# EAGLE design RaspberryShield (EAGLE 6.5.0)
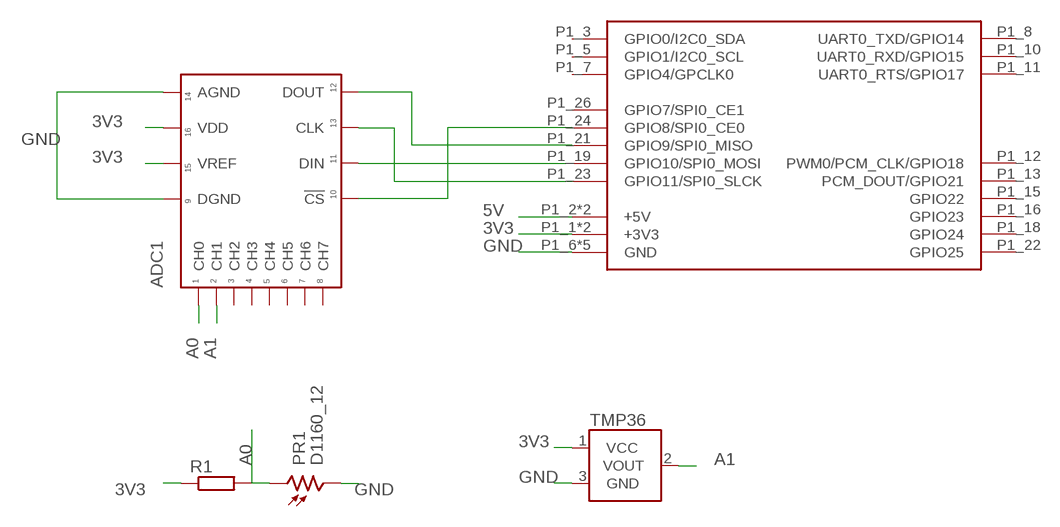
[diagram p0: schematic, sheet 1]

## Parts
ADC1  21298EDIP  [DIP16]
PR1  D1160_12  [D11XX]
R1  R-EU_0207/7  [0207/7]
TMP36  TMP36GT9  [TO-92]
U$1  RPI-B-V1SHIELD  [RPI-B-V1-SHIELD]

## Nets
3V3: ADC1.P$15(VREF) ADC1.P$16(VDD) R1.1 TMP36.1(VCC) U$1.P1_1(+3V3) U$1.P1_17(+3V3)
5V: U$1.P1_2(+5V) U$1.P1_4(+5V)
A0: ADC1.P$1(CH0) PR1.1 R1.2
A1: ADC1.P$2(CH1) TMP36.2(VOUT)
GND: ADC1.P$9(DGND) ADC1.P$14(AGND) PR1.2 TMP36.3(GND) U$1.P1_6(GND) U$1.P1_9(GND) U$1.P1_14(GND) U$1.P1_20(GND) U$1.P1_25(GND)
N$3: ADC1.P$12(DOUT) U$1.P1_21(GPIO9/SPI0_MISO)
N$4: ADC1.P$11(DIN) U$1.P1_19(GPIO10/SPI0_MOSI)
N$5: ADC1.P$13(CLK) U$1.P1_23(GPIO11/SPI0_SLCK)
N$6: ADC1.P$10(!CS) U$1.P1_24(GPIO8/SPI0_CE0)
Unconnected: ADC1.P$3(CH2) ADC1.P$4(CH3) ADC1.P$5(CH4) ADC1.P$6(CH5) ADC1.P$7(CH6) ADC1.P$8(CH7) U$1.P1_3(GPIO0/I2C0_SDA) U$1.P1_5(GPIO1/I2C0_SCL) U$1.P1_7(GPIO4/GPCLK0) U$1.P1_8(UART0_TXD/GPIO14) U$1.P1_10(UART0_RXD/GPIO15) U$1.P1_11(UART0_RTS/GPIO17) U$1.P1_12(PWM0/PCM_CLK/GPIO18) U$1.P1_13(PCM_DOUT/GPIO21) U$1.P1_15(GPIO22) U$1.P1_16(GPIO23) U$1.P1_18(GPIO24) U$1.P1_22(GPIO25) U$1.P1_26(GPIO7/SPI0_CE1)

## Library data of the parts
ADC1 = Microchip:21298E
PR1 = photo-elements:D11: Photo Sensor Oil Burner Control Applications Source: http://optoelectronics.perkinelmer.com/content/Datasheets/DTS_PhotocellsD1160.pdf
R1 = resistor:R-EU_: RESISTOR, European symbol
TMP36 = SparkFun-Sensors:TMP36: Precision degC temp sensor, analog out
U$1 = raspberry:RPI-B-V1: First revision of the Model B board without P5 and P6 headers and mounting holes. Choose the "SHIELD" variant for a predefined Dimension layer.

## Board
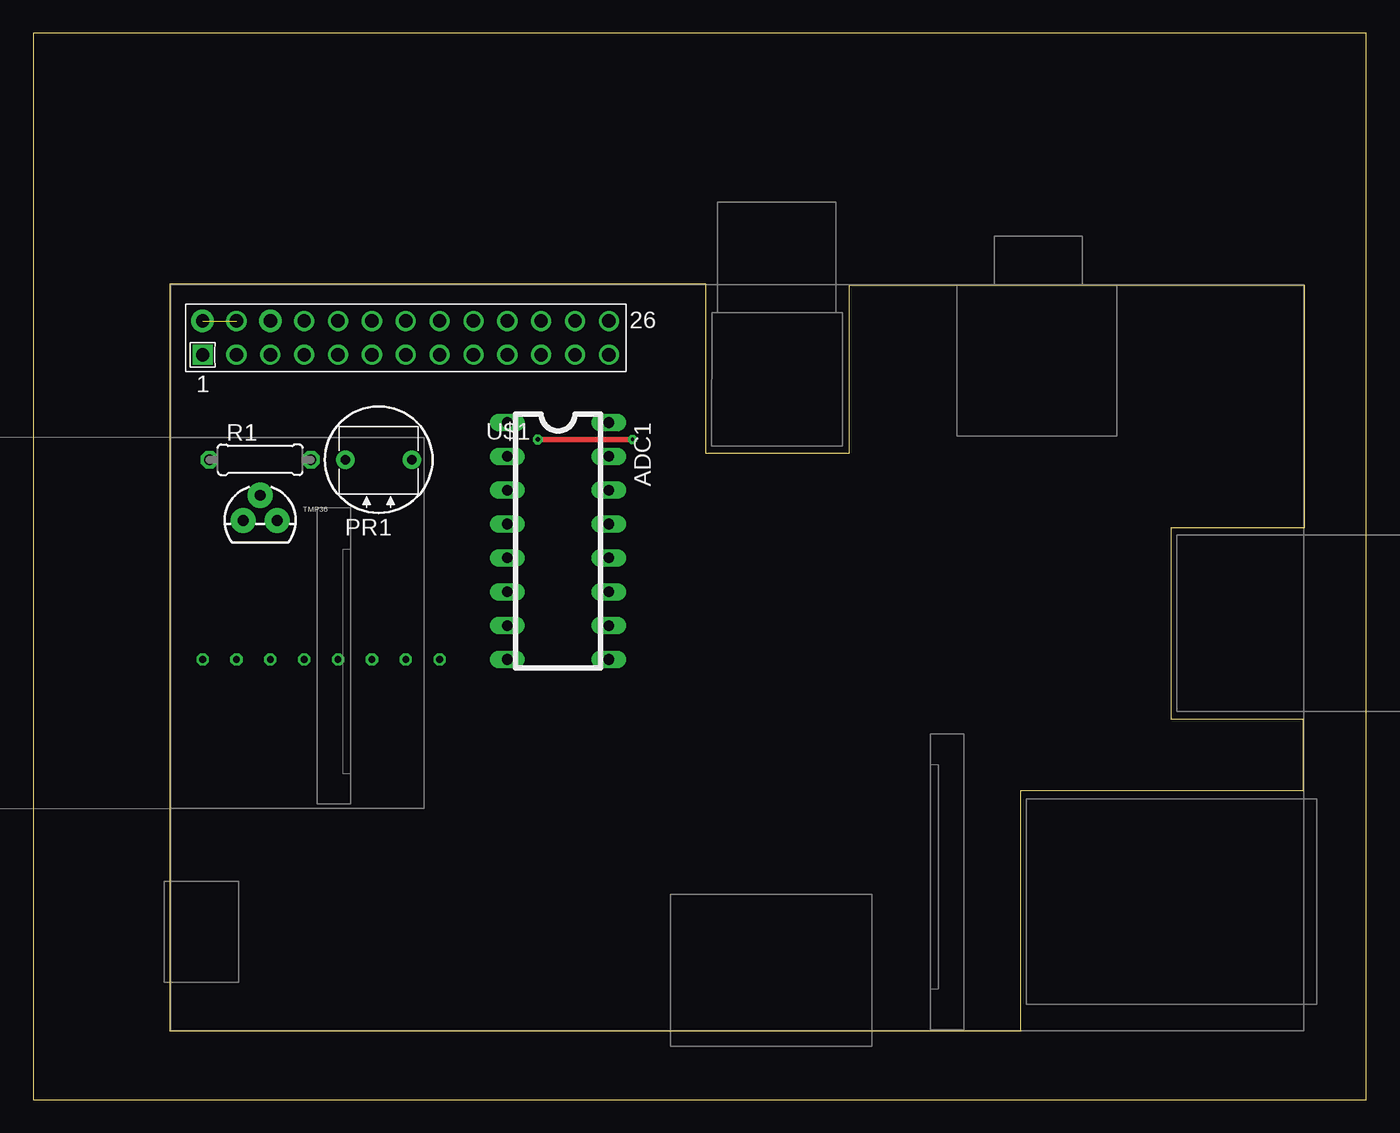
[diagram p1: board, top side]
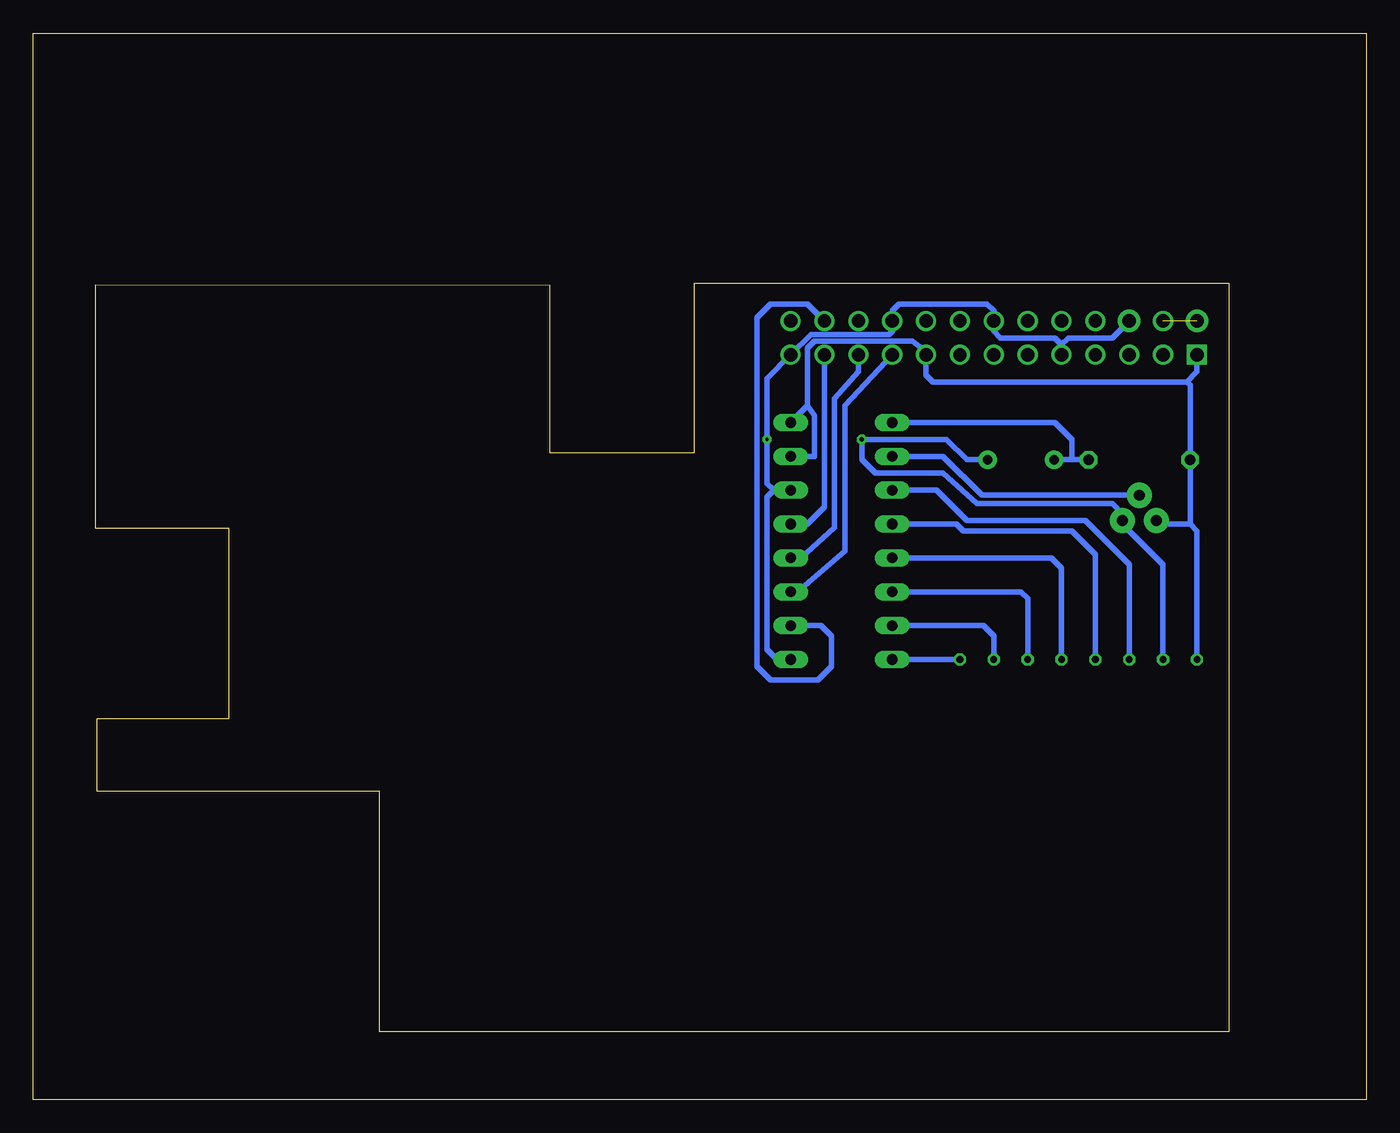
[diagram p2: board, bottom side, seen from below]

Size 100 x 80 mm. Coordinates in mm from the lower left corner, seen from the top.
Outline: 0,0 100,0 100,80 0,80 0,0
Copper layers (1*16): Top 0.035mm / dielectric 1.5mm / Bottom 0.035mm
Design rules "default": minimum track width 10mil, minimum drill 24mil, track to track 8mil, track to pad 8mil, pad to pad 8mil, via to via 8mil, smd to smd 8mil, copper to edge 40mil, drill to drill 8mil, minimum pad ring 10mil, minimum via ring 8mil, stop-mask expansion 4mil, vias tented up to drill 0mil, thermal gap 10mil

### Footprints (pad centres in the part's own frame; a part is rotated, then mirrored left to right if it is on the bottom)
DIP16 = drill 0.8 long: P$1 -10.16,-3.81; P$2 -7.62,-3.81; P$3 -5.08,-3.81; P$4 -2.54,-3.81; P$5 0,-3.81; P$6 2.54,-3.81; P$7 5.08,-3.81; P$8 7.62,-3.81; P$9 7.62,3.81; P$10 5.08,3.81; P$11 2.54,3.81; P$12 0,3.81; P$13 -2.54,3.81; P$14 -5.08,3.81; P$15 -7.62,3.81; P$16 -10.16,3.81
D11XX = drill 0.7 pad 1.4: 1 -2.5,0; 2 2.5,0
0207/7 = drill 0.813 octagon: 1 -3.81,0; 2 3.81,0
TO-92 = drill 0.813 pad 1.88: 1 -1.27,0; 2 0,1.905; 3 1.27,0
RPI-B-V1-SHIELD = drill 1 square: P1_1 0,0 | drill 1 pad 1.676: P1_2 0,2.54; P1_6 5.08,2.54 | drill 1: P1_3 2.54,0; P1_4 2.54,2.54; P1_5 5.08,0; P1_7 7.62,0; P1_8 7.62,2.54; P1_9 10.16,0; P1_10 10.16,2.54; P1_11 12.7,0; P1_12 12.7,2.54; P1_13 15.24,0; P1_14 15.24,2.54; P1_15 17.78,0; P1_16 17.78,2.54; P1_17 20.32,0; P1_18 20.32,2.54; P1_19 22.86,0; P1_20 22.86,2.54; P1_21 25.4,0; P1_22 25.4,2.54; P1_23 27.94,0; P1_24 27.94,2.54; P1_25 30.48,0; P1_26 30.48,2.54

### Placement (x,y rotation side)
ADC1  39.37,40.64 270 top
PR1  25.91,48.01 0 top
R1  17.02,48.01 0 top
TMP36  17.02,43.43 0 top
U$1  12.7,55.88 0 top

### Tracks (layer width: path | path; a pad name or v marks a point on that pad's centre or on a via)
3V3  (via drill 0.5 pad 0.41)
  Bottom 0.406: 41.91,52.07 41.91,56.39 41.4,56.9 34.04,56.9 33.02,56.13 U$1.P1_17 33.02,54.36 32.51,53.85 13.46,53.85 | U$1.P1_1 12.7,54.61 13.46,53.85 | 41.91,52.07 41.4,51.31 41.4,48.26 ADC1.P$15 | 41.91,52.07 ADC1.P$16 | 13.46,53.85 13.21,53.59 R1.1 13.21,43.18 | 13.21,43.18 15.49,43.18 TMP36.1 | 13.21,43.18 12.7,42.67 v12.7,33.02
5V  (1 unrouted)
A0
  Bottom 0.406: R1.2 22.1,48.01 | 22.1,48.01 PR1.1 | 22.1,48.01 22.1,49.53 23.37,50.8 ADC1.P$1
A1
  Bottom 0.406: TMP36.2 28.83,45.34 31.75,48.26 ADC1.P$2
GND  (via drill 0.25 pad 0.25, 0.33 pad 0.25, 0.5 pad 0.41)
  Top 0.406: v37.85,49.53 v44.96,49.53
  Bottom 0.406: 44.45,45.72 44.96,46.23 v44.96,49.53 44.96,54.1 U$1.P1_25 41.66,57.4 35.81,57.4 35.56,57.66 U$1.P1_20 35.56,59.18 35.05,59.69 28.45,59.69 27.94,59.18 U$1.P1_14 27.94,57.66 27.43,57.15 23.37,57.15 22.86,56.64 | ADC1.P$14 44.45,45.72 | 44.45,45.72 44.96,45.21 44.96,33.78 44.2,33.02 ADC1.P$9 | U$1.P1_6 19.05,57.15 22.35,57.15 22.86,56.64 | U$1.P1_9 22.86,56.64 | PR1.2 29.97,48.01 31.5,49.53 v37.85,49.53 37.85,48.01 36.83,46.99 31.75,46.99 29.21,44.7 19.05,44.7 18.29,43.94 18.29,43.69 TMP36.3 18.29,43.18 15.24,40.13 v15.24,33.02
N$1  (via drill 0.5 pad 0.41)
  Bottom 0.406: 35.31,33.02 v30.48,33.02
N$3
  Bottom 0.406: U$1.P1_21 38.1,54.61 39.88,52.58 39.88,42.93 42.42,40.64 ADC1.P$12
N$4
  Bottom 0.406: U$1.P1_19 39.12,52.07 39.12,41.15 42.67,38.1 ADC1.P$11
N$5
  Bottom 0.406: U$1.P1_23 40.64,44.45 41.91,43.18 ADC1.P$13
N$6
  Bottom 0.406: U$1.P1_24 41.91,59.69 44.7,59.69 45.72,58.67 45.72,32.51 44.7,31.5 41.15,31.5 40.13,32.51 40.13,34.8 40.89,35.56 ADC1.P$10
N$8  (via drill 0.5 pad 0.41)
  Bottom 0.406: v22.86,33.02 22.86,39.88 23.62,40.64 35.31,40.64
N$9  (via drill 0.5 pad 0.41)
  Bottom 0.406: v20.32,33.02 20.32,40.89 22.1,42.67 30.23,42.67 30.73,43.18 35.31,43.18
N$10  (via drill 0.5 pad 0.41)
  Bottom 0.406: v17.78,33.02 17.78,40.13 21.08,43.43 29.97,43.43 32.26,45.72 35.31,45.72
N$11  (via drill 0.5 pad 0.41)
  Bottom 0.406: 35.31,38.1 25.91,38.1 25.4,37.59 v25.4,33.02
N$12  (via drill 0.5 pad 0.41)
  Bottom 0.406: 35.31,35.56 28.7,35.56 27.94,34.8 v27.94,33.02